# Altium schematic sheet [07] - ETHERNET.SchDoc: ETHERNET
size A4; Organization: Bjørn T. Brodtkorb; Address1: Frode Rinnans veg 161; Address2: 7050 Trondheim; DocumentNumber: 8; Revision: 1.0; SheetNumber: 8; SheetTotal: 13
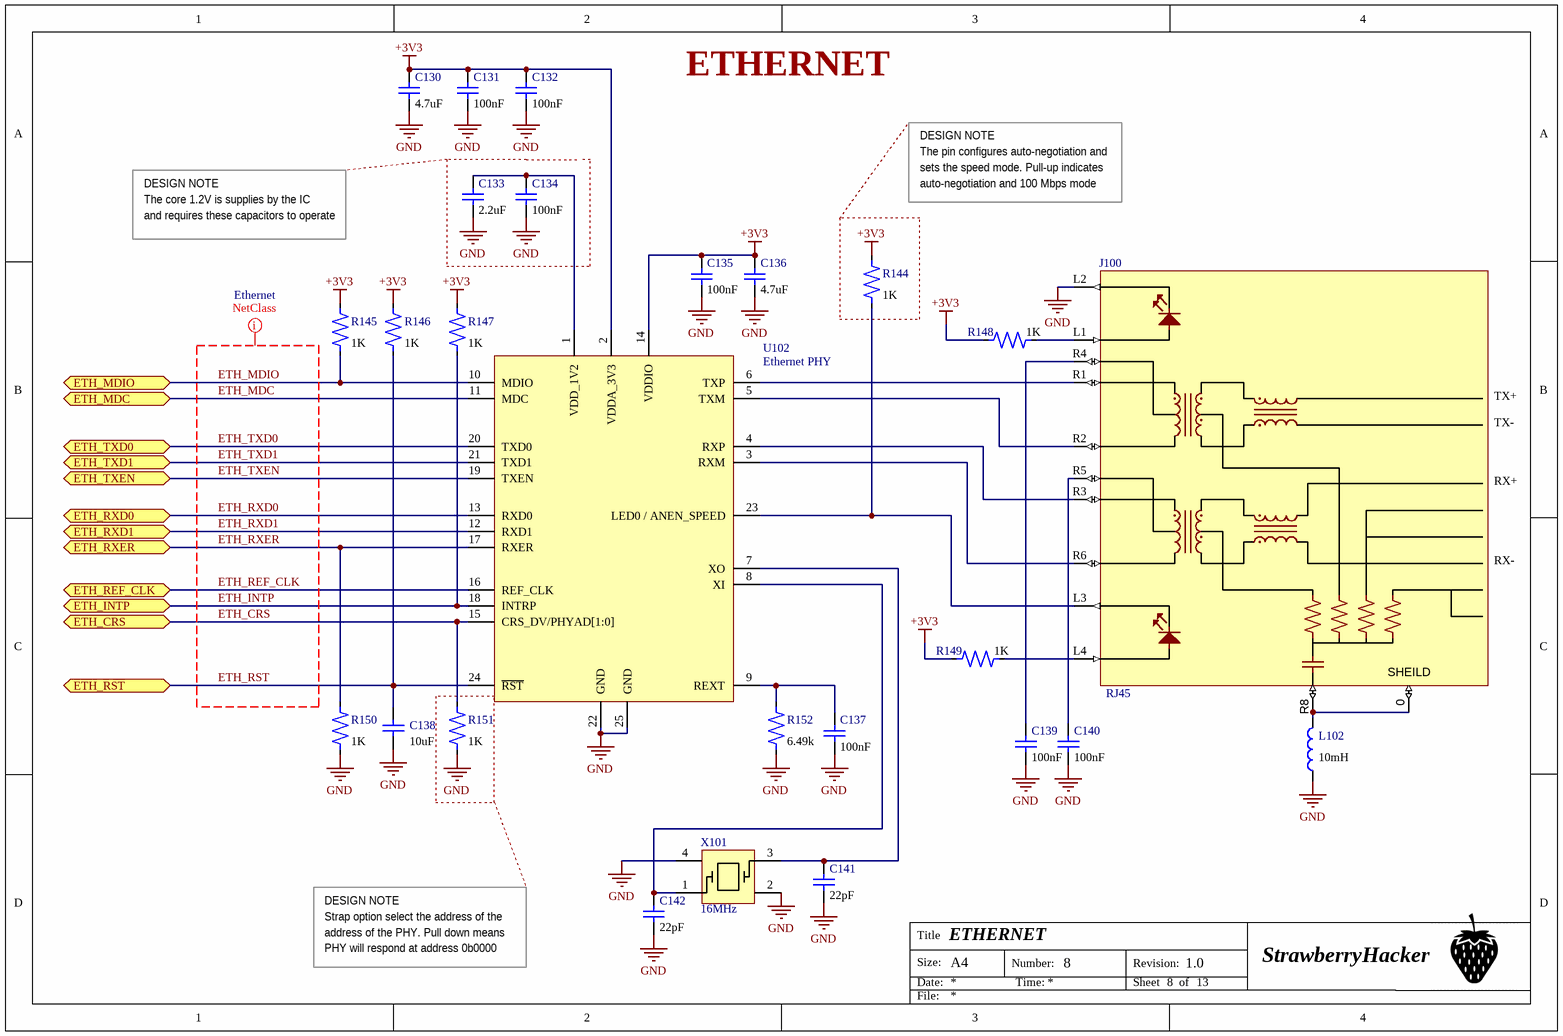
[diagram p0: [07] - ETHERNET.SchDoc]

## Parts
C130  value 4.7uF  [C0603]  (hidden comment: 02016D104KAT2A)
C131  value 100nF  [C0402]  (hidden comment: 04023C103KAT2A)
C132  value 100nF  [C0402]  (hidden comment: 04023C103KAT2A)
C133  value 2.2uF  [C0603]  (hidden comment: 02016D104KAT2A)
C134  value 100nF  [C0402]  (hidden comment: 04023C103KAT2A)
C135  value 100nF  [C0402]  (hidden comment: 04023C103KAT2A)
C136  value 4.7uF  [C0603]  (hidden comment: 02016D104KAT2A)
C137  value 100nF  [C0402]  (hidden comment: 04023C103KAT2A)
C138  value 10uF  [C0603]  (hidden comment: 02016D104KAT2A)
C139  value 100nF  [C0402]  (hidden comment: 04023C103KAT2A)
C140  value 100nF  [C0402]  (hidden comment: 04023C103KAT2A)
C141  value 22pF  [C0402]  (hidden comment: 04023C103KAT2A)
C142  value 22pF  [C0402]  (hidden comment: 04023C103KAT2A)
J100  RJ45  [RJ45 8P8C LED & magnetics]
L102  value 10mH  [Inductor 0603]  (hidden comment: MLZ1608A2R2WT)
R144  value 1K  [R0402]  (hidden comment: CRCW04020000Z0ED)
R145  value 1K  [R0402]  (hidden comment: CRCW04020000Z0ED)
R146  value 1K  [R0402]  (hidden comment: CRCW04020000Z0ED)
R147  value 1K  [R0402]  (hidden comment: CRCW04020000Z0ED)
R148  value 1K  [R0402]  (hidden comment: CRCW04020000Z0ED)
R149  value 1K  [R0402]  (hidden comment: CRCW04020000Z0ED)
R150  value 1K  [R0402]  (hidden comment: CRCW04020000Z0ED)
R151  value 1K  [R0402]  (hidden comment: CRCW04020000Z0ED)
R152  value 6.49k  [R0402]  (hidden comment: CRCW04020000Z0ED)
U102  Ethernet PHY  [KSZ8081RNACA]
X101  16MHz  [MCSJK-7U-16.00-12-10-80-B-10]

## Ports
ETH_CRS (bidir), ETH_INTP (bidir), ETH_MDC (bidir), ETH_MDIO (bidir), ETH_REF_CLK (bidir), ETH_RST (bidir), ETH_RXD0 (bidir), ETH_RXD1 (bidir), ETH_RXER (bidir), ETH_TXD0 (bidir), ETH_TXD1 (bidir), ETH_TXEN (bidir)

## Nets
+3V3: C130.2 C131.2 C132.2 C135.2 C136.2 R144.2 R145.2 R146.2 R147.2 R148.1 R149.1 U102.2(VDDA_3V3) U102.14(VDDIO)
GND: C130.1 C131.1 C132.1 C133.1 C134.1 C135.1 C136.1 C137.1 C138.1 C139.1 C140.1 C141.1 C142.1 J100.L2 L102.1 R150.1 R151.1 R152.1 U102.22(GND) U102.25(GND) X101.2 X101.4
ETH_CRS: R151.2 U102.15(CRS_DV/PHYAD[1:0]) ; port ETH_CRS
ETH_INTP: R147.1 U102.18(INTRP) ; port ETH_INTP
ETH_MDC: U102.11(MDC) ; port ETH_MDC
ETH_MDIO: R145.1 U102.10(MDIO) ; port ETH_MDIO
ETH_REF_CLK: U102.16(REF_CLK) ; port ETH_REF_CLK
ETH_RST: C138.2 R146.1 U102.24(~{RST}) ; port ETH_RST
ETH_RXD0: U102.13(RXD0) ; port ETH_RXD0
ETH_RXD1: U102.12(RXD1) ; port ETH_RXD1
ETH_RXER: R150.2 U102.17(RXER) ; port ETH_RXER
ETH_TXD0: U102.20(TXD0) ; port ETH_TXD0
ETH_TXD1: U102.21(TXD1) ; port ETH_TXD1
ETH_TXEN: U102.19(TXEN) ; port ETH_TXEN
NetC133_2: C133.2 C134.2 U102.1(VDD_1V2)
NetC137_2: C137.2 R152.2 U102.9(REXT)
NetC139_2: C139.2 J100.R4
NetC140_2: C140.2 J100.R5
NetC141_2: C141.2 U102.7(XO) X101.3
NetC142_2: C142.2 U102.8(XI) X101.1
NetJ100_0: J100.0 J100.R8 L102.2
NetJ100_L1: J100.L1 R148.2
NetJ100_L3: J100.L3 R144.1 U102.23(LED0_/_ANEN_SPEED)
NetJ100_L4: J100.L4 R149.2
NetJ100_R1: J100.R1 U102.6(TXP)
NetJ100_R2: J100.R2 U102.5(TXM)
NetJ100_R3: J100.R3 U102.4(RXP)
NetJ100_R6: J100.R6 U102.3(RXM)

Not connected (* = marked no-connect by the designer): J100 1 2

## Layout directives
net class Ethernet: ETH_CRS, ETH_INTP, ETH_MDC, ETH_MDIO, ETH_REF_CLK, ETH_RST, ETH_RXD0, ETH_RXD1, ETH_RXER, ETH_TXD0, ETH_TXD1, ETH_TXEN

## Notes on the sheet
- ETHERNET
- DESIGN NOTE
- The pin configures auto-negotiation and
- sets the speed mode. Pull-up indicates
- The core 1.2V is supplies by the IC
- and requires these capacitors to operate
- auto-negotiation and 100 Mbps mode
- Strap option select the address of the
- address of the PHY. Pull down means
- PHY will respond at address 0b0000
- Title
- Size:
- Date:
- A4
- Number:
- Time:
- Revision:
- Sheet
- of
- StrawberryHacker
- File:
- (in symbol 234235-2-2-1-12) TX+; TX-; RX+; RX-; SHEILD

## Library data of the parts
C130 C133 C136 C138 = 02016D104KAT2A: C0603
C131 C132 C134 C135 C137 C139-C142 = 04023C103KAT2A: C0402
J100 = 234235-2-2-1-12: RJ45 8P8C LED & magnetics; Supplier 1: Digi-Key; Supplier Part Number 1: RJMG1BD3B8K1ANR-ND
L102 = MLZ1608A2R2WT: Inductor 0603
R144-R152 = CRCW04020000Z0ED: R0402
U102 = KSZ8081RNACA: Ethernet PHY 10BASE-T/100BASE; Supplier 1: Farnell; Supplier Part Number 1: 2809920
X101 = MCSJK-7U-16.00-12-10-80-B-10_1: Crystal 25MHx 3.2mm x 2.5mm, 16pF; Supplier 1: Farnell; Supplier Part Number 1: 1674655